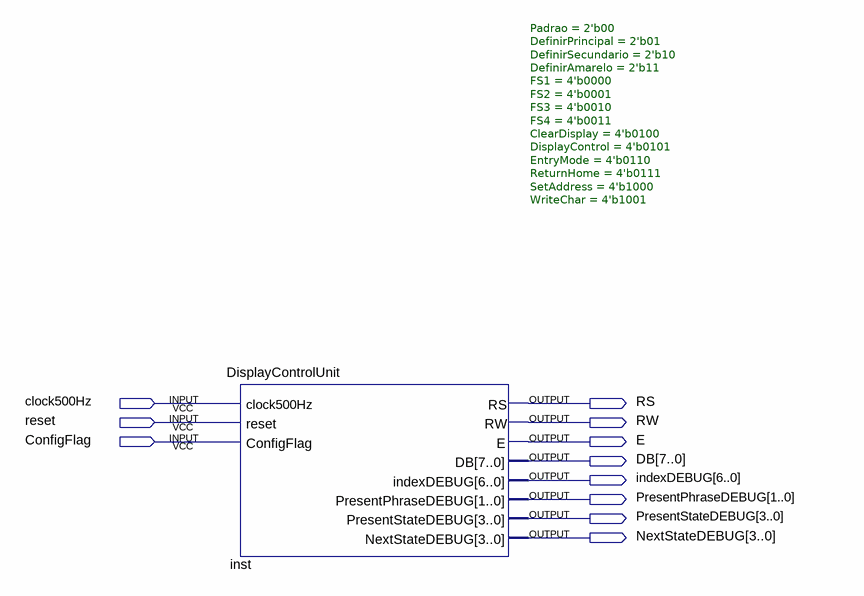
[diagram p0: schematic sheet]
// Quartus schematic test.bdf as structural Verilog: 1 symbols, 11 pins
module test (
  input  clock500Hz,
  input  reset,
  input  ConfigFlag,
  output RS,
  output RW,
  output E,
  output [7:0] DB,
  output [6:0] indexDEBUG,
  output [1:0] PresentPhraseDEBUG,
  output [3:0] PresentStateDEBUG,
  output [3:0] NextStateDEBUG
);

  DisplayControlUnit #(.Padrao(2'b00), .DefinirPrincipal(2'b01), .DefinirSecundario(2'b10), .DefinirAmarelo(2'b11), .FS1(4'b0000), .FS2(4'b0001), .FS3(4'b0010), .FS4(4'b0011), .ClearDisplay(4'b0100), .DisplayControl(4'b0101), .EntryMode(4'b0110), .ReturnHome(4'b0111), .SetAddress(4'b1000), .WriteChar(4'b1001)) inst (
    .clock500Hz(clock500Hz), .reset(reset), .ConfigFlag(ConfigFlag), .RS(RS), .RW(RW), .E(E), .DB(DB),
    .indexDEBUG(indexDEBUG), .PresentPhraseDEBUG(PresentPhraseDEBUG), .PresentStateDEBUG(PresentStateDEBUG),
    .NextStateDEBUG(NextStateDEBUG));
endmodule
